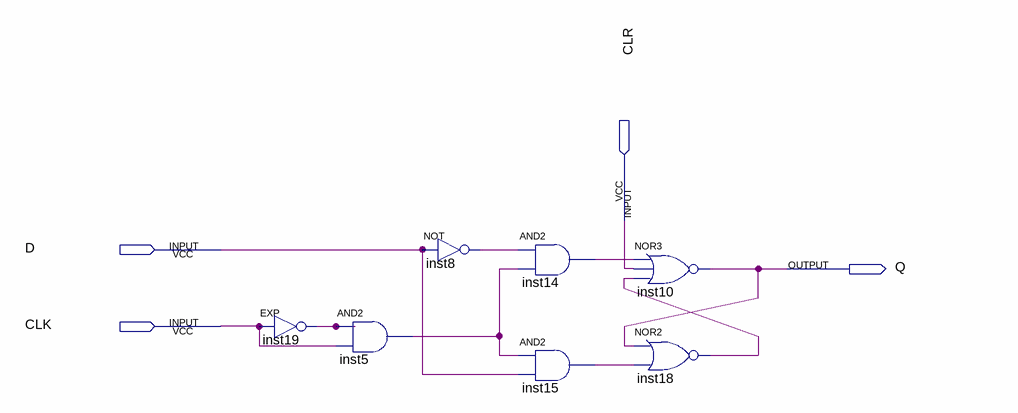
[diagram p0: schematic sheet]
// Quartus schematic FlipFlopD.bdf as structural Verilog: 7 symbols, 4 pins
module FlipFlopD (
  input  CLR,
  input  D,
  input  CLK,
  output Q
);

  wire inst5_out, inst8_out, inst14_out, inst15_out, inst18_out, inst19_out;

  EXP inst19 (.IN(CLK), .OUT(inst19_out));
  and inst5 (inst5_out, inst19_out, CLK);
  not inst8 (inst8_out, D);
  and inst14 (inst14_out, inst8_out, inst5_out);
  and inst15 (inst15_out, inst5_out, D);
  nor inst10 (Q, inst14_out, CLR, inst18_out);
  nor inst18 (inst18_out, Q, inst15_out);
endmodule
